# EAGLE design B115A (EAGLE 6.6.0)
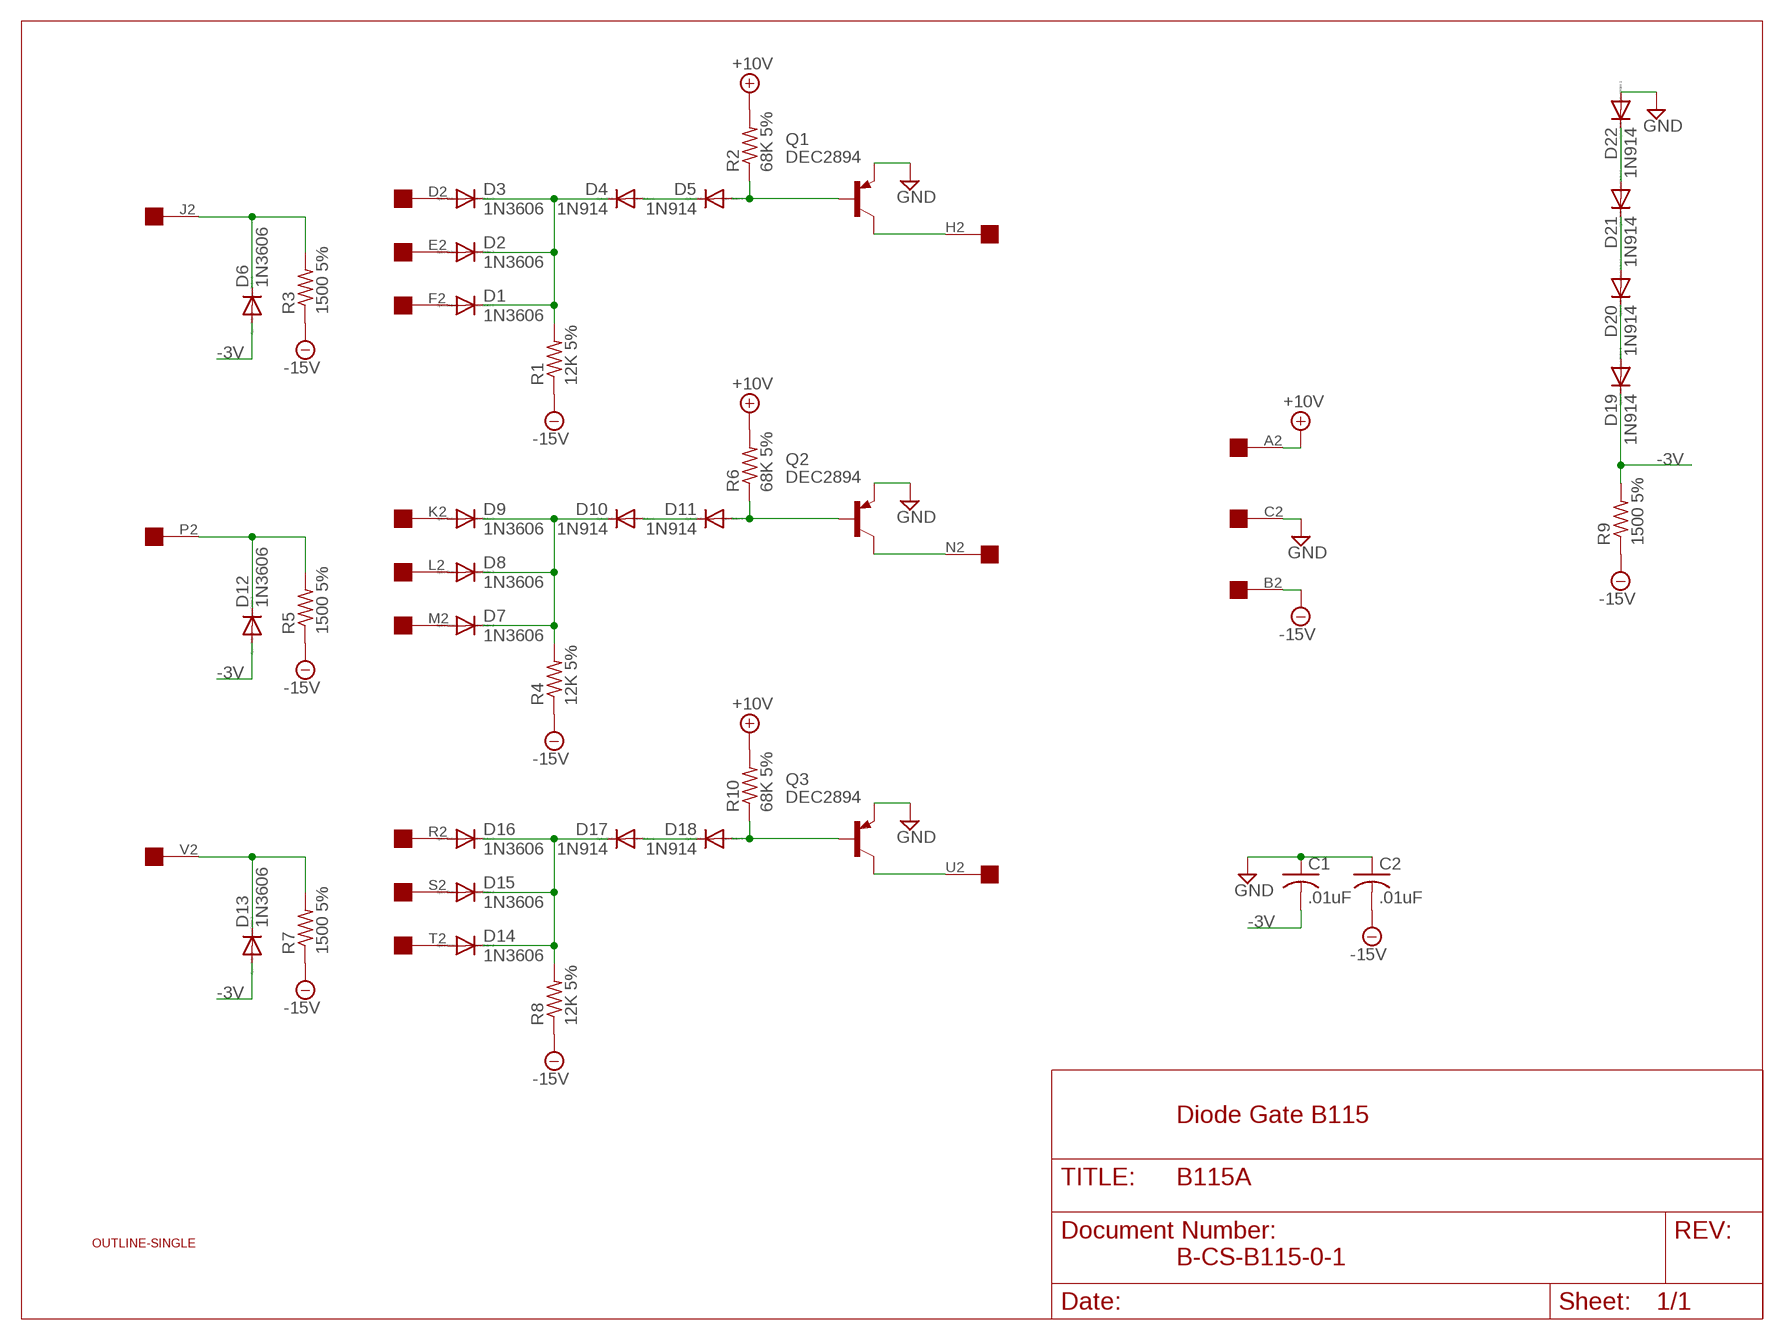
[diagram p0: schematic, sheet 1]

## Parts
C1  .01uF  C-US050-025X075  [C050-025X075]
C2  .01uF  C-US050-025X075  [C050-025X075]
D1  1N3606  1N4148DO35-10  [DO35-10]
D2  1N3606  1N4148DO35-10  [DO35-10]
D3  1N3606  1N4148DO35-10  [DO35-10]
D4  1N914  1N4148DO35-10  [DO35-10]
D5  1N914  1N4148DO35-10  [DO35-10]
D6  1N3606  1N4148DO35-10  [DO35-10]
D7  1N3606  1N4148DO35-10  [DO35-10]
D8  1N3606  1N4148DO35-10  [DO35-10]
D9  1N3606  1N4148DO35-10  [DO35-10]
D10  1N914  1N4148DO35-10  [DO35-10]
D11  1N914  1N4148DO35-10  [DO35-10]
D12  1N3606  1N4148DO35-10  [DO35-10]
D13  1N3606  1N4148DO35-10  [DO35-10]
D14  1N3606  1N4148DO35-10  [DO35-10]
D15  1N3606  1N4148DO35-10  [DO35-10]
D16  1N3606  1N4148DO35-10  [DO35-10]
D17  1N914  1N4148DO35-10  [DO35-10]
D18  1N914  1N4148DO35-10  [DO35-10]
D19  1N914  1N4148DO35-10  [DO35-10]
D20  1N914  1N4148DO35-10  [DO35-10]
D21  1N914  1N4148DO35-10  [DO35-10]
D22  1N914  1N4148DO35-10  [DO35-10]
Q1  DEC2894  2N2904  [TO39]
Q2  DEC2894  2N2904  [TO39]
Q3  DEC2894  2N2904  [TO39]
R1  12K 5%  R-US_0207/10  [0207/10]
R2  68K 5%  R-US_0207/10  [0207/10]
R3  1500 5%  R-US_0207/10  [0207/10]
R4  12K 5%  R-US_0207/10  [0207/10]
R5  1500 5%  R-US_0207/10  [0207/10]
R6  68K 5%  R-US_0207/10  [0207/10]
R7  1500 5%  R-US_0207/10  [0207/10]
R8  12K 5%  R-US_0207/10  [0207/10]
R9  1500 5%  R-US_0207/10  [0207/10]
R10  68K 5%  R-US_0207/10  [0207/10]
U$1  OUTLINE-SINGLE  [SINGLE]
U$2  EDGE-1  [EDGE-CON1]

## Nets
+10V: R2.2 R6.2 R10.2 U$2.A2
-3V [Supply]: C1.2 D6.A D12.A D13.A D19.C R9.2
-15V: C2.2 R1.1 R3.1 R4.1 R5.1 R7.1 R8.1 R9.1 U$2.B2
GND [Supply]: C1.1 C2.1 D22.A Q1.1(E) Q2.1(E) Q3.1(E) U$2.C2
N$1: D7.C D8.C D9.C D10.C R4.2
N$2: D1.A U$2.F2
N$3: D5.A Q1.2(B) R2.1
N$4: D2.A U$2.E2
N$5: D1.C D2.C D3.C D4.C R1.2
N$6: D9.A U$2.K2
N$7: D8.A U$2.L2
N$8: D7.A U$2.M2
N$9: D10.A D11.C
N$10: D3.A U$2.D2
N$11: Q1.3(C) U$2.H2
N$12: D11.A Q2.2(B) R6.1
N$13: Q2.3(C) U$2.N2
N$14: D14.C D15.C D16.C D17.C R8.2
N$15: D4.A D5.C
N$16: D16.A U$2.R2
N$17: D6.C R3.2 U$2.J2
N$18: D15.A U$2.S2
N$19: D14.A U$2.T2
N$20: D12.C R5.2 U$2.P2
N$21: D17.A D18.C
N$22: D18.A Q3.2(B) R10.1
N$23: Q3.3(C) U$2.U2
N$25: D13.C R7.2 U$2.V2
N$26: D21.A D22.C
N$27: D20.A D21.C
N$29: D19.A D20.C

## Notes on the sheet
- Diode Gate B115
- B-CS-B115-0-1

## Library data of the parts
C1 C2 = rcl:C-US: CAPACITOR, American symbol
D1-D22 = diode:1N4148: DIODE high speed (Philips)
Q1-Q3 = transistor-pnp:2N2904*: PNP Transistror
R1-R10 = rcl:R-US_: RESISTOR, American symbol
U$1 = dec-con:OUTLINE-*: Board outlines for DEC boards.
U$2 = dec-con:EDGE-1: Single-Sided DEC Edge Connector -- (side 2)

## Net classes
1 Supply: width 0.813 mm

## Board
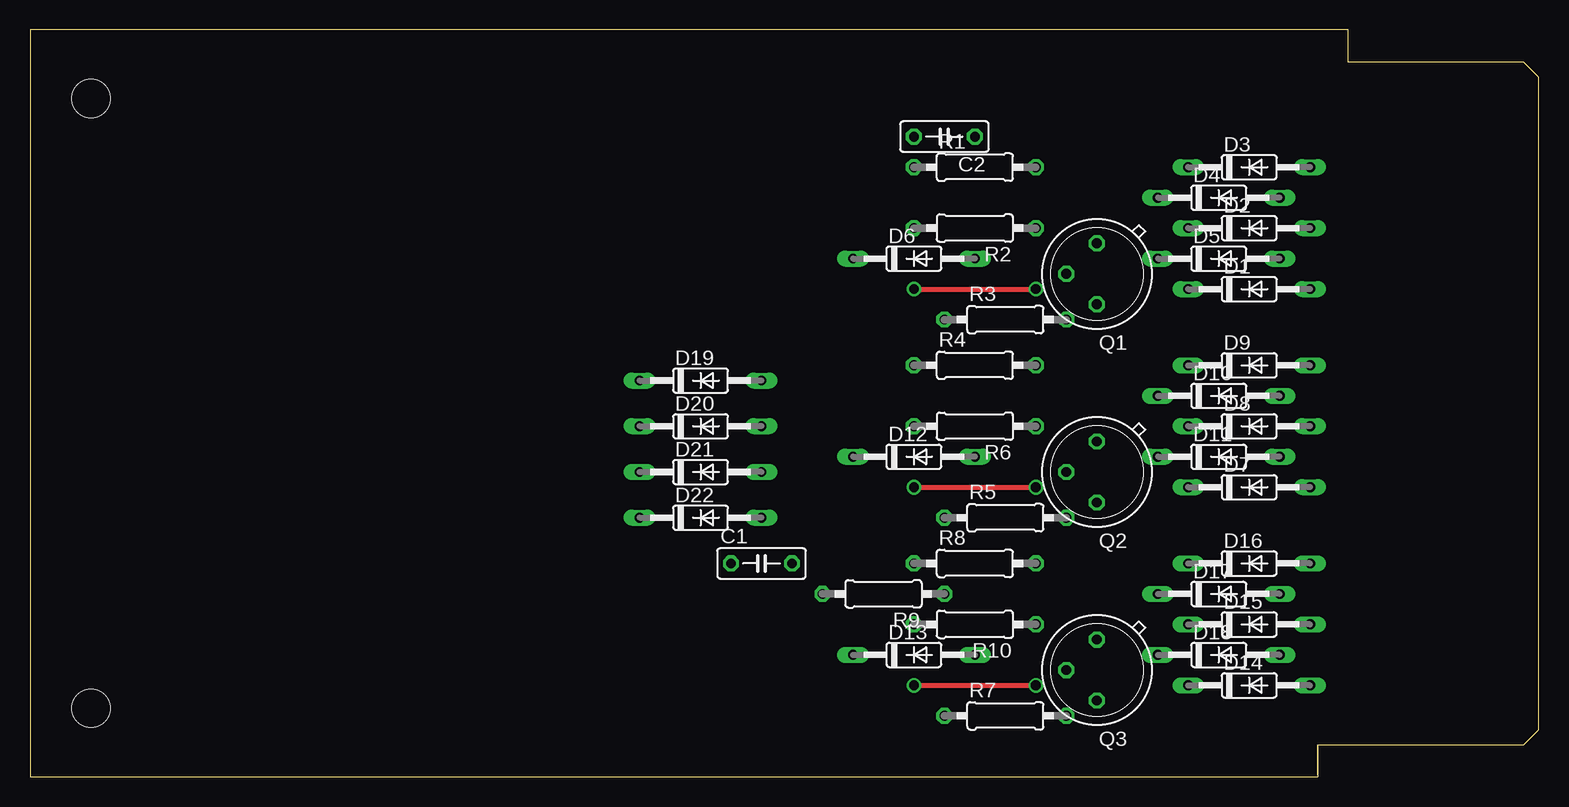
[diagram p1: board, top side]
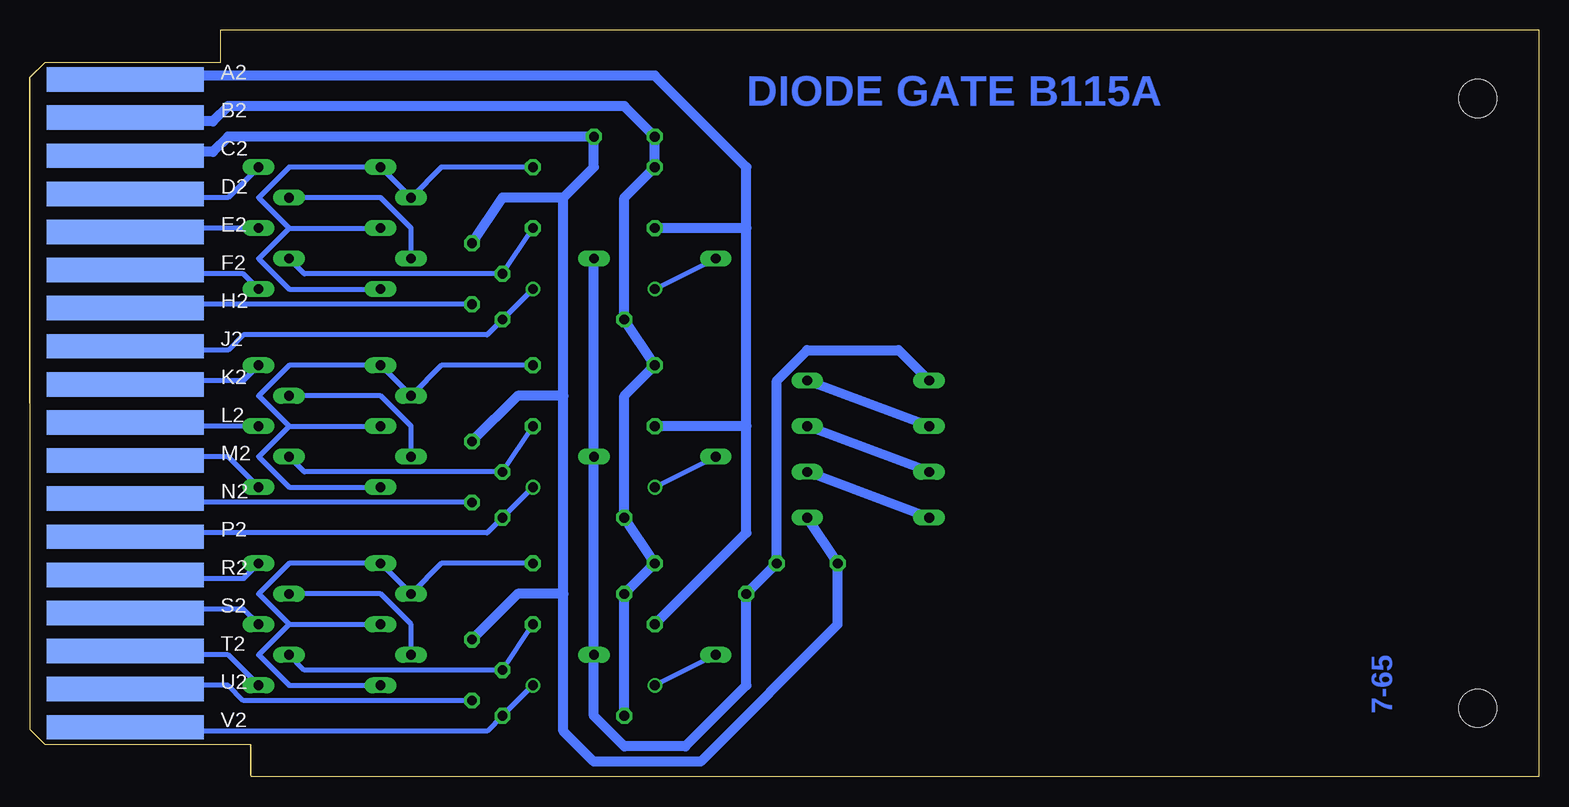
[diagram p2: board, bottom side, seen from below]

Size 125.73 x 62.23 mm. Coordinates in mm from the lower left corner, seen from the top.
Copper layers (1+16): Top 0.035mm / dielectric 1.5mm / Bottom 0.035mm
Design rules "16mils": minimum track width 16mil, minimum drill 32mil, track to track 15mil, track to pad 10mil, pad to pad 10mil, via to via 10mil, smd to smd 10mil, copper to edge 13mil, drill to drill 10mil, minimum pad ring 10mil, minimum via ring 8mil, stop-mask expansion 0mil, vias tented up to drill 0mil, thermal gap 10mil

### Footprints (pad centres in the part's own frame; a part is rotated, then mirrored left to right if it is on the bottom)
C050-025X075 = drill 0.813 octagon: 1 -2.54,0; 2 2.54,0
DO35-10 = drill 0.813 long: A 5.08,0; C -5.08,0
TO39 = drill 0.813 octagon: 1 0,-2.54; 2 2.54,0; 3 0,2.54
0207/10 = drill 0.813 octagon: 1 -5.08,0; 2 5.08,0
SINGLE = hole 3.175: 120.65,56.515; 120.65,5.715
EDGE-CON1 = smd 13.106 x 2.032 bottom: A2 7.938,4.128; B2 7.938,7.303; C2 7.938,10.477; D2 7.938,13.652; E2 7.938,16.828; F2 7.938,20.003; H2 7.938,23.177; J2 7.938,26.352; K2 7.938,29.527; L2 7.938,32.703; M2 7.938,35.877; N2 7.938,39.053; P2 7.938,42.227; R2 7.938,45.403; S2 7.938,48.578; T2 7.938,51.752; U2 7.938,54.928; V2 7.938,58.102

### Placement (x,y rotation side)
C1  60.96,17.78 0 top
C2  76.2,53.34 180 top
D1  101.6,40.64 0 top
D2  101.6,45.72 0 top
D3  101.6,50.8 0 top
D4  99.06,48.26 0 top
D5  99.06,43.18 0 top
D6  73.66,43.18 0 top
D7  101.6,24.13 0 top
D8  101.6,29.21 0 top
D9  101.6,34.29 0 top
D10  99.06,31.75 0 top
D11  99.06,26.67 0 top
D12  73.66,26.67 0 top
D13  73.66,10.16 0 top
D14  101.6,7.62 0 top
D15  101.6,12.7 0 top
D16  101.6,17.78 0 top
D17  99.06,15.24 0 top
D18  99.06,10.16 0 top
D19  55.88,33.02 0 top
D20  55.88,29.21 0 top
D21  55.88,25.4 0 top
D22  55.88,21.59 0 top
Q1  88.9,41.91 180 top
Q2  88.9,25.4 180 top
Q3  88.9,8.89 180 top
R1  78.74,50.8 0 top
R2  78.74,45.72 180 top
R3  81.28,38.1 0 top
R4  78.74,34.29 0 top
R5  81.28,21.59 0 top
R6  78.74,29.21 180 top
R7  81.28,5.08 0 top
R8  78.74,17.78 0 top
R9  71.12,15.24 180 top
R10  78.74,12.7 180 top
U$1  125.73,62.23 180 top
U$2  125.73,62.23 180 top

### Tracks (layer width: path | path; a pad name or v marks a point on that pad's centre or on a via)
+10V
  Bottom 0.813: 66.04,45.72 R2.2 | 66.04,29.21 66.04,45.72 | 66.04,29.21 R6.2 | R10.2 66.04,20.32 66.04,29.21 | U$2.A2 116.84,58.42 73.66,58.42 66.04,50.8 66.04,45.72
-3V
  Bottom 0.813: D19.C 53.34,35.56 60.96,35.56 63.5,33.02 C1.2 R9.2 66.04,7.62 71.12,2.54 76.2,2.54 78.74,5.08 D13.A D12.A D6.A
-15V
  Bottom 0.813: R7.1 R9.1 R8.1 R5.1 76.2,31.75 R4.1 R3.1 76.2,48.26 R1.1 C2.2 76.2,55.88 109.22,55.88 110.49,54.61 116.84,54.61 U$2.B2
GND
  Bottom 0.813: D22.A C1.1 58.42,12.7 69.85,1.27 78.74,1.27 81.28,3.81 81.28,15.24 | 81.28,15.24 81.28,31.75 | 81.28,31.75 81.28,48.26 | 81.28,48.26 78.74,50.8 C2.1 109.22,53.34 110.49,52.07 116.84,52.07 U$2.C2 | 81.28,15.24 85.09,15.24 Q3.1 | Q2.1 85.09,31.75 81.28,31.75 | Q1.1 86.36,48.26 81.28,48.26
N$1
  Bottom 0.406: D7.C 104.14,24.13 106.68,26.67 104.14,29.21 | 104.14,29.21 106.68,31.75 104.14,34.29 D9.C D10.C 91.44,34.29 R4.2 | 104.14,29.21 D8.C
N$2
  Bottom 0.406: U$2.F2 117.12,42.19 116.84,41.91 107.95,41.91 D1.A
N$3
  Bottom 0.406: D5.A 102.87,41.91 Q1.2 R2.1
N$4
  Bottom 0.406: U$2.E2 117.17,45.39 116.84,45.72 D2.A
N$5
  Bottom 0.406: D1.C 104.14,40.64 106.68,43.18 104.14,45.72 | 104.14,45.72 106.68,48.26 104.14,50.8 D3.C D4.C 91.44,50.8 R1.2 | 104.14,45.72 D2.C
N$6
  Bottom 0.406: U$2.K2 117.14,32.72 116.84,33.02 107.95,33.02 D9.A
N$7
  Bottom 0.406: U$2.L2 117.17,29.54 116.84,29.21 D8.A
N$8
  Bottom 0.406: U$2.M2 117.17,26.34 116.84,26.67 109.22,26.67 D7.A
N$9
  Bottom 0.406: D10.A 96.52,31.75 93.98,29.21 D11.C
N$10
  Bottom 0.406: U$2.D2 117.14,48.56 116.84,48.26 109.22,48.26 D3.A
N$11
  Bottom 0.406: U$2.H2 117.17,39.04 116.84,39.37 Q1.3
N$12
  Bottom 0.406: D11.A 102.87,25.4 Q2.2 R6.1
N$13
  Bottom 0.406: U$2.N2 117.17,23.19 116.84,22.86 Q2.3
N$14
  Bottom 0.406: 104.14,12.7 106.68,15.24 104.14,17.78 D16.C D17.C 91.44,17.78 R8.2 | 104.14,12.7 106.68,10.16 104.14,7.62 D14.C | 104.14,12.7 D15.C
N$15
  Bottom 0.406: D4.A 96.52,48.26 93.98,45.72 D5.C
N$16
  Bottom 0.406: U$2.R2 117.17,16.84 116.84,16.51 107.95,16.51 D16.A
N$17  (via drill 0.81)
  Top 0.406: v73.66,40.64 v83.82,40.64
  Bottom 0.406: U$2.J2 117.17,35.89 116.84,35.56 109.22,35.56 107.95,36.83 87.63,36.83 R3.2 v83.82,40.64 | D6.C v73.66,40.64
N$18
  Bottom 0.406: U$2.S2 117.14,13.66 116.84,13.97 107.95,13.97 D15.A
N$19
  Bottom 0.406: U$2.T2 117.17,10.49 116.84,10.16 109.22,10.16 D14.A
N$20  (via drill 0.81)
  Top 0.406: v73.66,24.13 v83.82,24.13
  Bottom 0.406: U$2.P2 115.9,19.99 115.57,20.32 87.63,20.32 R5.2 v83.82,24.13 | D12.C v73.66,24.13
N$21
  Bottom 0.406: D17.A 96.52,15.24 93.98,12.7 D18.C
N$22
  Bottom 0.406: D18.A 102.87,8.89 Q3.2 R10.1
N$23
  Bottom 0.406: U$2.U2 117.2,7.26 116.84,7.62 109.22,7.62 107.95,6.35 Q3.3
N$25  (via drill 0.81)
  Top 0.406: v73.66,7.62 v83.82,7.62
  Bottom 0.406: U$2.V2 117.16,4.13 116.84,3.81 87.63,3.81 R7.2 v83.82,7.62 | D13.C v73.66,7.62
N$26
  Bottom 0.813: D22.C D21.A
N$27
  Bottom 0.813: D21.C D20.A
N$29
  Bottom 0.813: D20.C D19.A

### Text on the board
Bottom: DIODE GATE B115A | 7-65